# EAGLE design HLF356amp-revisi01 (EAGLE 7.6.0)
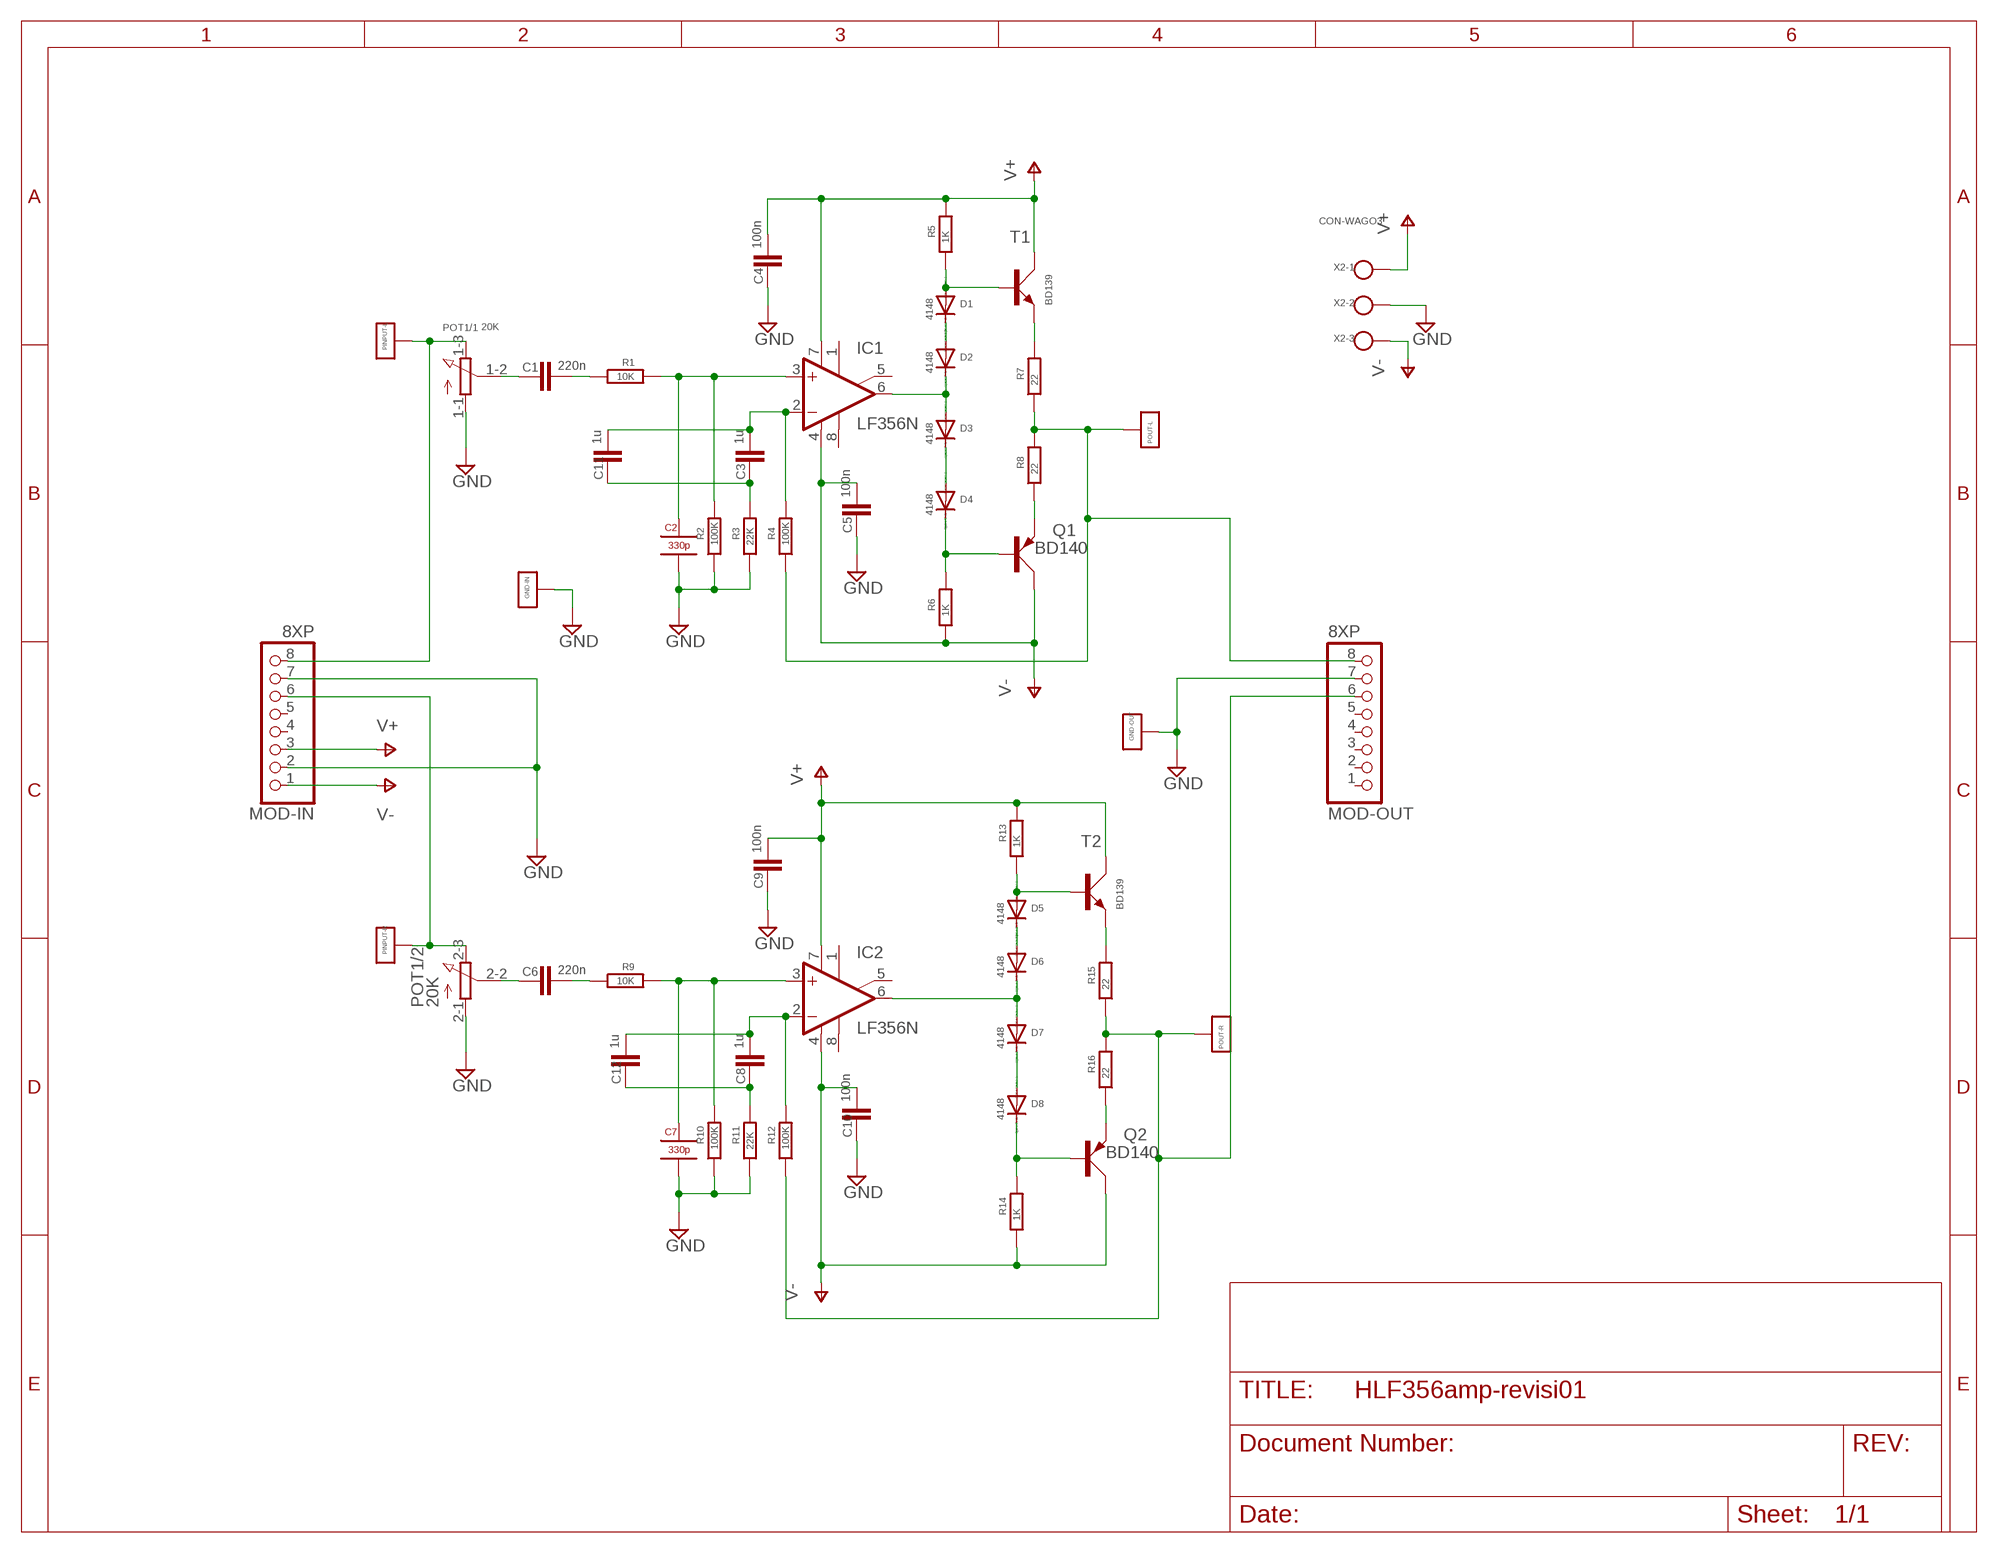
[diagram p0: schematic, sheet 1]

## Parts
C1  220n  C-EU050-025X075  [C050-025X075]
C2  330p  RIFAEVOXPFR5  [RIFAEVOX]
C3  1u  C-EU150-072X183  [C150-072X183]
C4  100n  C-EU050-025X075  [C050-025X075]
C5  100n  C-EU050-025X075  [C050-025X075]
C6  220n  C-EU050-025X075  [C050-025X075]
C7  330p  RIFAEVOXPFR5  [RIFAEVOX]
C8  1u  C-EU150-072X183  [C150-072X183]
C9  100n  C-EU050-025X075  [C050-025X075]
C10  100n  C-EU050-025X075  [C050-025X075]
C11  1u  C-EU050-075X075  [C050-075X075]
C12  1u  C-EU050-075X075  [C050-075X075]
D1  4148  1N4148DO35-7  [DO35-7]
D2  4148  1N4148DO35-7  [DO35-7]
D3  4148  1N4148DO35-7  [DO35-7]
D4  4148  1N4148DO35-7  [DO35-7]
D5  4148  1N4148DO35-7  [DO35-7]
D6  4148  1N4148DO35-7  [DO35-7]
D7  4148  1N4148DO35-7  [DO35-7]
D8  4148  1N4148DO35-7  [DO35-7]
GND-IN  PIN-BIG1X  [PIN-BIG]
GND-OUT  PIN-BIG1X  [PIN-BIG]
IC1  LF356N  [DIL08]
IC2  LF356N  [DIL08]
MOD-IN  8XP  PINHD-1X8BIG  [1X08-BIG]
MOD-OUT  8XP  PINHD-1X8BIG  [1X08-BIG]
PINPUT-L  PIN-BIG1X  [PIN-BIG]
PINPUT-R  PIN-BIG1X  [PIN-BIG]
POT1  20K  3RP/1610G  [3RP/1610G]
POUT-L  PIN-BIG1X  [PIN-BIG]
POUT-R  PIN-BIG1X  [PIN-BIG]
Q1  BD140  [TO126AV]
Q2  BD140  [TO126AV]
R1  10K  R-EU_0204/7  [0204/7]
R2  100K  R-EU_0204/7  [0204/7]
R3  22K  R-EU_0204/7  [0204/7]
R4  100K  R-EU_0204/7  [0204/7]
R5  1K  R-EU_0204/7  [0204/7]
R6  1K  R-EU_0204/7  [0204/7]
R7  22  R-EU_0204/7  [0204/7]
R8  22  R-EU_0204/7  [0204/7]
R9  10K  R-EU_0204/7  [0204/7]
R10  100K  R-EU_0204/7  [0204/7]
R11  22K  R-EU_0204/7  [0204/7]
R12  100K  R-EU_0204/7  [0204/7]
R13  1K  R-EU_0204/7  [0204/7]
R14  1K  R-EU_0204/7  [0204/7]
R15  22  R-EU_0204/7  [0204/7]
R16  22  R-EU_0204/7  [0204/7]
T1  BD139  [TO126AV]
T2  BD139  [TO126AV]
X2  CON-WAGO3  W237-103  [W237-103]

## Nets
AMP-INL: MOD-IN.8 PINPUT-L.P$1 POT1.1-3(/1:E)
AMP-INR: MOD-IN.6 PINPUT-R.P$1 POT1.2-3(/2:E)
AMP-OUTL: MOD-OUT.8 POUT-L.P$1 R4.1 R7.1 R8.2
AMP-OUTR: MOD-OUT.6 POUT-R.P$1 R12.1 R15.1 R16.2
B1: D1.A R5.1 T1.B
B2: D4.C Q1.B R6.2
B3: D5.A R13.1 T2.B
B4: D8.C Q2.B R14.2
E1: R7.2 T1.E
E2: Q1.E R8.1
E3: R15.2 T2.E
E4: Q2.E R16.1
GND: C2.P$2 C4.1 C5.1 C7.P$2 C9.1 C10.1 GND-IN.P$1 GND-OUT.P$1 MOD-IN.2 MOD-IN.7 MOD-OUT.7 POT1.1-1(/1:A) POT1.2-1(/2:A) R2.1 R3.1 R10.1 R11.1 X2.2
N$1: C2.P$1 IC1.3(+IN) R1.2 R2.2
N$2: C1.2 R1.1
N$3: C3.2 C11.2 IC1.2(-IN) R4.2
N$4: C3.1 C11.1 R3.2
N$5: C1.1 POT1.1-2(/1:S)
N$7: C7.P$1 IC2.3(+IN) R9.2 R10.2
N$9: D1.C D2.A
N$10: D2.C D3.A IC1.6(OUT)
N$11: D3.C D4.A
N$13: C6.2 R9.1
N$16: C8.2 C12.2 IC2.2(-IN) R12.2
N$17: C8.1 C12.1 R11.2
N$20: C6.1 POT1.2-2(/2:S)
N$22: D5.C D6.A
N$23: D6.C D7.A IC2.6(OUT)
N$24: D7.C D8.A
V+: C4.2 C9.2 IC1.7(V+) IC2.7(V+) MOD-IN.3 R5.2 R13.2 T1.C T2.C X2.1
V-: C5.2 C10.2 IC1.4(V-) IC2.4(V-) MOD-IN.1 Q1.C Q2.C R6.1 R14.1 X2.3
Unconnected: IC1.1(ON1) IC1.5(ON2) IC1.8(OPT) IC2.1(ON1) IC2.5(ON2) IC2.8(OPT) MOD-IN.4 MOD-IN.5 MOD-OUT.1 MOD-OUT.2 MOD-OUT.3 MOD-OUT.4 MOD-OUT.5

## Library data of the parts
C1 C3-C6 C8-C12 = resistor:C-EU: CAPACITOR, European symbol
C2 C7 = ioshub:RIFAEVOX: Rifa Evox
D1-D8 = diode:1N4148: DIODE high speed (Philips)
GND-IN GND-OUT PINPUT-L PINPUT-R POUT-L POUT-R = ioshub:PIN-BIG: 1X 1.0 mm pin big
IC1 IC2 = linear:LF356: OP AMP
MOD-IN MOD-OUT = adafruit:PINHD-1X8: PIN HEADER
POT1 = pot2:3RP/1610G: 16mm Potentiometer two level Source: http://www.alphapotentiometers.net/html/16mm_pot_2.html
Q1 Q2 = transistor-power:BD140: PNP TRANSISTOR
R1-R16 = resistor:R-EU_: RESISTOR, European symbol
T1 T2 = transistor-power:BD139: NPN TRANSISTOR
X2 = con-wago-500:W237-103: WAGO SCREW CLAMP; MPN: 237-103; OC_FARNELL: unknown; OC_NEWARK: 18M7116

## Board
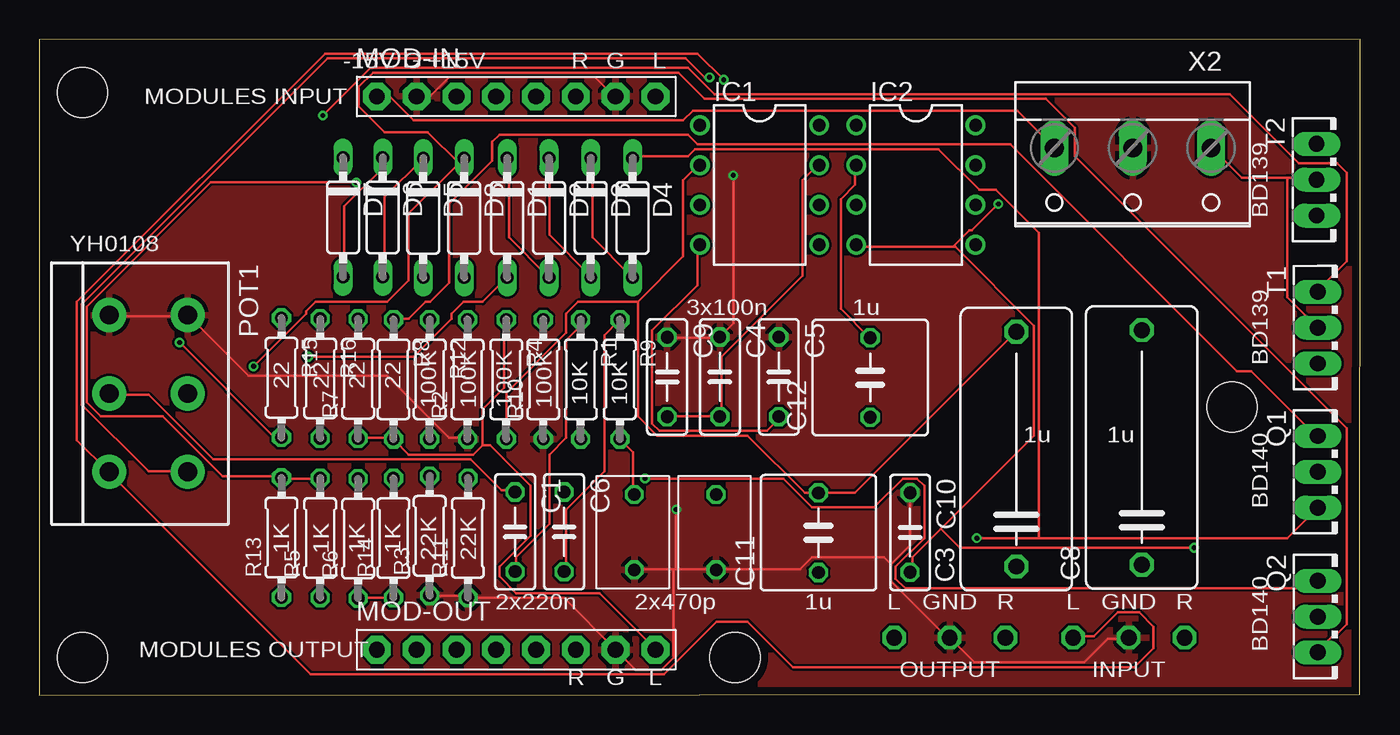
[diagram p1: board, top side]
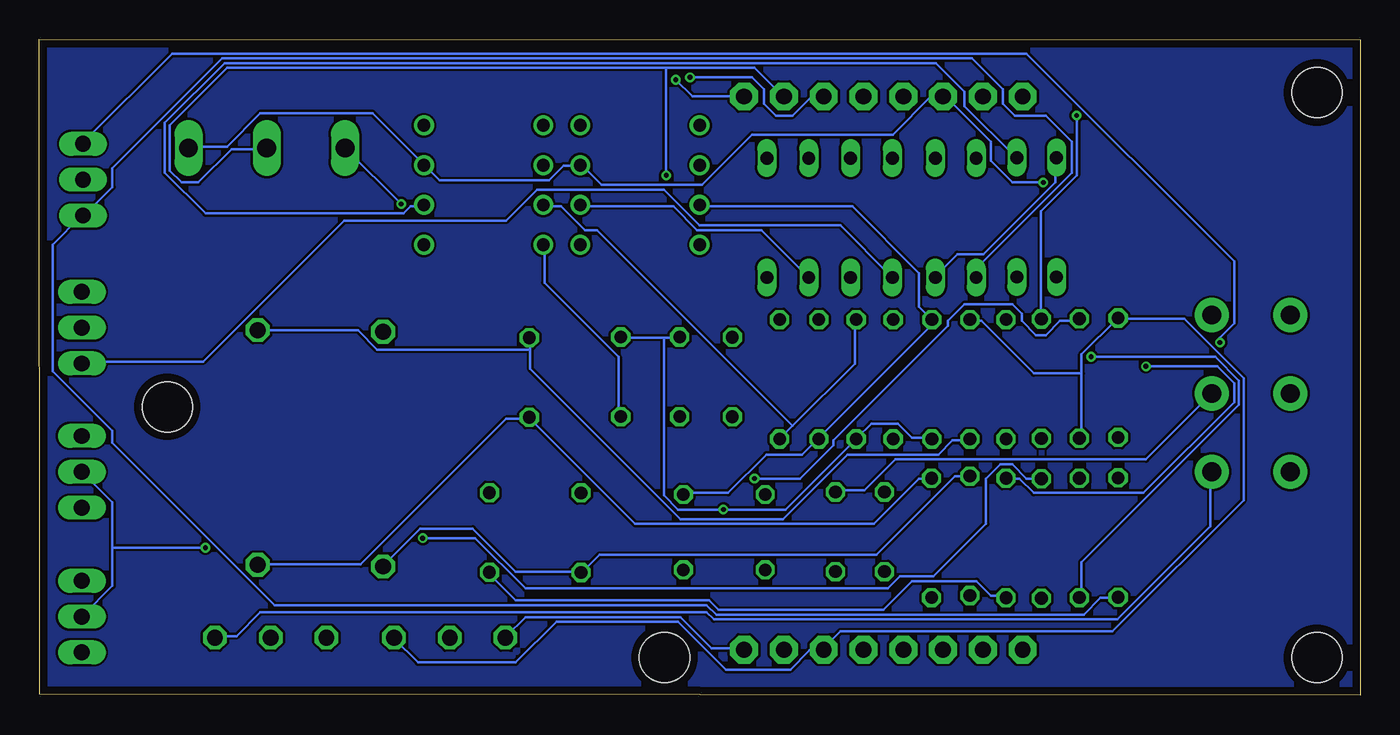
[diagram p2: board, bottom side, seen from below]

Size 84.36 x 41.88 mm. Coordinates in mm from the lower left corner, seen from the top.
Outline: 0,0 84.32,0.07 84.36,41.88 0.01,41.83 0,0
Copper layers (1*16): Top 0.035mm / dielectric 1.6mm / Bottom 0.035mm
Design rules "Elecrow_2-layer_PCB_eagle_rule": minimum track width 6mil, minimum drill 12mil, track to track 6mil, track to pad 8mil, pad to pad 12mil, via to via 12mil, smd to smd 0mil, copper to edge 20mil, drill to drill 10mil, minimum pad ring 6mil, minimum via ring 6mil, stop-mask expansion 0mil, vias tented up to drill 100mil, thermal gap 10mil
Holes 3.2 mm at 2.77,38.48 2.77,2.41 76.17,18.41 44.43,2.41

### Footprints (pad centres in the part's own frame; a part is rotated, then mirrored left to right if it is on the bottom)
C050-025X075 = drill 0.813 octagon: 1 -2.54,0; 2 2.54,0
RIFAEVOX = drill 0.8 octagon: P$1 -2.375,-0.255; P$2 2.425,-0.255
C150-072X183 = drill 1.016 octagon: 1 -7.493,0; 2 7.493,0
C050-075X075 = drill 0.813 octagon: 1 -2.54,0; 2 2.54,0
DO35-7 = drill 0.813 long: A 3.81,0; C -3.81,0
PIN-BIG = drill 1 octagon: P$1 0,0
DIL08 = drill 0.813 pad 1.27: 1 -3.81,-3.81; 2 -1.27,-3.81; 3 1.27,-3.81; 4 3.81,-3.81; 5 3.81,3.81; 6 1.27,3.81; 7 -1.27,3.81; 8 -3.81,3.81
1X08-BIG = drill 1.016 pad 1.778 octagon: 1 -8.89,0; 2 -6.35,0; 3 -3.81,0; 4 -1.27,0; 5 1.27,0; 6 3.81,0; 7 6.35,0; 8 8.89,0
3RP/1610G = drill 1.2 pad 2.184: 1-1 -5,0; 1-2 0,0; 1-3 5,0; 2-1 -5,5; 2-2 0,5; 2-3 5,5
TO126AV = drill 1.016 long: B 2.286,-1.27; C 0,-1.27; E -2.286,-1.27
0204/7 = drill 0.813 octagon: 1 -3.81,0; 2 3.81,0
W237-103 = drill 1.194 long: 1 -5,-1.29; 2 0,-1.29; 3 5,-1.29

### Placement (x,y rotation side)
C1  30.39,10.44 270 top
C2  43.48,10.44 270 top
C3  62.39,15.72 90 top
C4  43.46,20.33 270 top
C5  47.22,20.33 270 top
C6  33.51,10.44 270 top
C7  38.26,10.44 270 top
C8  70.4,15.82 90 top
C9  40.1,20.32 270 top
C10  55.61,10.4 270 top
C11  49.76,10.38 90 top
C12  53.06,20.29 90 top
D1  29.88,30.48 270 top
D2  32.55,30.48 270 top
D3  35.21,30.48 270 top
D4  37.89,30.48 270 top
D5  24.52,30.48 270 top
D6  21.93,30.51 270 top
D7  19.41,30.51 270 top
D8  27.13,30.48 270 top
GND-IN  69.57,3.68 180 top
GND-OUT  58.14,3.68 90 top
IC1  45.99,32.57 270 top
IC2  55.98,32.57 270 top
MOD-IN  30.46,38.23 0 top
MOD-OUT  30.46,2.92 0 top
PINPUT-L  66.02,3.68 180 top
PINPUT-R  73.13,3.68 180 top
POT1  4.48,19.27 270 top
POUT-L  54.59,3.68 90 top
POUT-R  61.7,3.68 90 top
Q1  82.91,14.27 270 top
Q2  82.91,5.03 270 top
R1  34.58,20.17 270 top
R2  27.35,20.17 90 top
R3  24.93,10.19 90 top
R4  29.83,20.17 270 top
R5  17.94,10.05 90 top
R6  20.36,10.01 90 top
R7  20.36,20.21 90 top
R8  22.62,20.17 270 top
R9  37.08,20.17 270 top
R10  32.19,20.17 90 top
R11  27.38,10.05 90 top
R12  24.93,20.17 270 top
R13  15.47,10.07 90 top
R14  22.62,10.04 90 top
R15  15.47,20.27 270 top
R16  17.94,20.23 270 top
T1  82.91,23.47 270 top
T2  82.83,32.91 270 top
X2  69.82,33.65 180 top

### Tracks (layer width: path | path; a pad name or v marks a point on that pad's centre or on a via)
AMP-INL  (via drill 0.3)
  Top 0.152: v43.71,39.29 42.04,40.97 18.26,40.97 2.41,25.12 2.41,16.28 4.39,14.3 POT1.1-3 4.55,14.15 17.35,1.34 39.9,1.34 43.26,4.7 45.24,4.7 48.13,1.8 69.93,1.8 71.15,3.02 71.15,4.39 70.23,5.31 68.86,5.31 67.34,3.78 66.12,3.78 PINPUT-L.P$1
  Bottom 0.152: MOD-IN.8 42.65,38.23 v43.71,39.29
AMP-INR  (via drill 0.3)
  Top 0.152: v42.8,39.44 42.5,39.44 41.27,40.66 18.42,40.66 2.72,24.97 2.72,18.57 6.98,14.3 9.42,14.3 POT1.2-3
  Bottom 0.152: MOD-IN.6 35.03,38.23 36.25,37.01 37.31,37.01 38.08,37.77 38.08,38.68 38.84,39.44 v42.8,39.44 | PINPUT-R.P$1 73.13,3.78 71.75,3.78 70.23,5.31 41.73,5.31 41.27,4.85 15.52,4.85 9.58,10.79 9.58,14.15 POT1.2-3
AMP-OUTL
  Top 0.152: R7.1 20.4,16.43 22.53,16.43 R8.2 22.68,16.28 23.6,15.37 27.71,15.37 28.32,15.97 | 28.32,15.97 28.32,18.26 29.69,19.63 29.69,23.9 R4.1 | 28.32,15.97 28.78,15.97 31.37,13.38 31.37,10.18 29.39,8.2 29.39,7.59 30.46,6.53 35.79,6.53 39.29,3.02 MOD-OUT.8
  Bottom 0.152: MOD-OUT.8 39.45,3.02 41.43,3.02 43.41,5 53.32,5 54.53,3.78 POUT-L.P$1
AMP-OUTR
  Bottom 0.152: 17.81,20.55 17.81,16.43 R16.2 | 17.81,20.55 17.81,21.77 15.52,24.05 R15.1 15.37,24.05 11.25,24.05 7.44,20.24 7.44,12.47 15.82,4.09 33.2,4.09 34.27,3.02 MOD-OUT.6 34.27,2.87 35.18,2.87 36.4,1.65 40.51,1.65 43.56,4.7 51.33,4.7 53.93,2.11 60.17,2.11 61.7,3.63 POUT-R.P$1 | 17.81,20.55 20.85,20.55 24.21,23.9 24.82,23.9 R12.1
B1  (via drill 0.3)
  Top 0.152: v17.2,21.61 23.9,21.61 26.34,24.05 26.34,24.36 27.1,25.12 28.32,25.12 29.85,26.64 D1.A
  Bottom 0.152: v17.2,21.61 9.27,21.61 7.75,20.09 7.75,18.57 17.81,8.51 17.81,6.37 R5.1 | T1.B 81.51,21.31 73.89,21.31 64.9,30.3 54.53,30.3 52.55,32.28 44.48,32.28 42.19,30 33.2,30 30,26.8 D1.A
B2  (via drill 0.3)
  Top 0.152: 63.83,10.03 79.68,10.03 81.51,11.86 Q1.B | 63.83,10.03 v59.87,10.03 | 63.83,10.03 63.83,29.54 61.09,32.28 60.02,32.28 57.43,34.87 41.88,34.87 41.43,34.41 37.92,34.41 D4.C
  Bottom 0.152: v59.87,10.03 56.52,10.03 53.32,6.83 30.15,6.83 29.39,7.59 27.26,7.59 23.9,10.95 23.9,13.84 22.99,14.76 22.23,14.76 21.31,13.84 20.4,13.84 R6.2
B3
  Bottom 0.152: R13.1 15.52,6.22 16.59,6.22 17.65,5.15 41.12,5.15 41.73,5.76 69.32,5.76 79.68,16.13 79.68,16.89 83.49,20.7 83.49,28.78 81.66,30.61 T2.B 81.51,30.61 79.68,32.43 79.68,33.65 72.67,40.66 24.82,40.66 22.84,38.68 22.84,37.77 22.07,37.01 20.09,37.01 18.42,35.33 18.42,33.35 24.51,27.25 24.51,26.8 D5.A
B4  (via drill 0.3)
  Top 0.152: v13.69,21 17.04,24.36 17.04,24.51 17.65,25.12 22.23,25.12 23.6,26.49 23.6,30.76 26.8,33.96 | 26.8,33.96 27.1,34.26 D8.C 26.8,33.96 | 26.8,33.96 24.82,35.94 22.07,35.94 20.4,37.62 20.4,38.84 21.31,39.75 40.82,39.75 42.5,38.07 64.29,38.07 66.12,36.24 66.12,34.41 83.49,17.04 83.49,4.54 82.88,3.94 82.73,3.94 81.66,2.87 Q2.B
  Bottom 0.152: v13.69,21 9.12,21 8.05,19.94 8.05,18.72 13.84,12.93 20.85,12.93 21.77,13.84 22.53,13.84 R14.2
E1  (via drill 0.3)
  Top 0.152: v18.11,37.01 21.16,40.05 41.43,40.05 43.1,38.38 76.02,38.38 80.44,33.96 82.88,33.96 83.49,33.35 83.49,27.71 81.66,25.88 T1.E
  Bottom 0.152: v18.11,37.01 18.11,33.2 20.4,30.91 20.4,24.05 R7.2
E2
  Top 0.152: R8.1 22.68,24.05 23.6,24.05 24.66,25.12 24.97,25.12 26.19,26.34 26.19,31.37 28.93,34.11 28.93,35.33 29.39,35.79 41.43,35.79 42.04,35.18 62,35.18 76.48,20.7 77.39,20.7 81.51,16.58 Q1.E
E3  (via drill 0.3)
  Top 0.152: v8.97,22.53 14.91,16.58 15.37,16.58 R15.2
  Bottom 0.152: v8.97,22.53 8.97,22.83 8.05,23.75 8.05,27.71 21.31,40.97 75.87,40.97 81.51,35.33 T2.E
E4  (via drill 0.3)
  Top 0.152: v38.69,13.84 47.52,13.84 49.35,12.01 53.32,12.01 55.14,13.84 56.06,13.84 56.52,13.38 56.52,10.03 54.69,8.2 54.69,7.44 55.3,6.83 81.05,6.83 81.51,7.29 Q2.E
  Bottom 0.152: v38.69,13.84 35.79,13.84 33.66,15.97 33.66,16.28 26.34,23.59 26.34,23.9 25.27,24.97 22.23,24.97 21.62,24.36 21.62,23.9 20.7,22.98 20.09,22.98 19.18,23.9 17.96,23.9 R16.1
GND  (via drill 0.3)
  Top 0.152: 40.67,8.05 43.1,8.05 C2.P$2 43.26,8.05 48.59,8.05 49.35,8.81 53.93,8.81 54.38,8.36 | 40.67,8.05 40.51,8.05 | 40.51,8.05 38.08,8.05 C7.P$2 | R3.1 24.97,6.37 27.26,6.37 R11.1 27.41,6.22 33.5,6.22 MOD-OUT.7 38.08,1.65 39.75,1.65 40.51,2.41 40.51,8.05 | 54.38,8.36 55.6,9.57 55.6,12.93 C10.1 | 54.38,8.36 54.38,7.29 58.04,3.63 GND-OUT.P$1 59.72,2.11 66.73,2.11 68.25,3.63 69.47,3.63 GND-IN.P$1 | MOD-IN.2 24.97,38.23 26.19,39.44 35.48,39.44 36.7,38.23 MOD-IN.7 | C9.1 40.21,22.83 43.41,22.83 C4.1 43.56,22.98 44.32,23.75 v44.32,33.2 | R2.1 27.26,16.43 26.19,16.43 22.23,20.39 13.39,20.39 9.58,24.2 POT1.2-1 9.42,24.2 4.55,24.2 POT1.1-1 | v40.67,11.86 40.67,8.05
  Bottom 0.152: 44.32,40.05 38.69,40.05 36.86,38.23 MOD-IN.7 | 44.32,40.05 72.36,40.05 76.02,36.4 76.02,33.5 75.26,32.74 74.19,32.74 72.06,34.87 69.93,34.87 X2.2 | 44.48,22.83 43.56,22.83 C4.1 | 44.48,22.83 47.22,22.83 C5.1 | R2.1 27.41,16.43 28.63,16.43 29.54,17.35 31.22,17.35 32.13,16.43 R10.1 32.28,16.28 36.7,11.86 v40.67,11.86 43.56,11.86 44.48,12.77 44.48,22.83 | v44.32,33.2 44.32,40.05
  pour Top: 0.23,0.12 84.3,0.12 84.3,42.03 -0.03,42.03
N$1
  Bottom 0.152: C2.P$1 43.1,12.93 40.36,12.93 37.92,15.37 35.64,15.37 34.72,16.28 R1.2 34.57,16.43 27.41,23.59 27.41,23.9 R2.2 27.41,24.05 28.17,24.81 28.17,26.95 32.44,31.21 42.04,31.21 IC1.3
N$2
  Top 0.152: C1.2 30.46,8.05 30.46,8.81 32.59,10.95 32.59,15.37 33.66,16.43 33.66,22.68 34.57,23.59 34.57,23.9 R1.1
N$3
  Top 0.152: C3.2 62.31,23.14 52.1,12.93 49.81,12.93 C11.2 49.66,12.93 48.9,12.93 45.24,16.58 39.45,16.58 38.23,17.8 38.23,25.12 | 38.23,25.12 34.42,25.12 33.66,24.36 33.66,23.14 29.85,19.33 29.85,16.43 R4.2 | 38.23,25.12 41.12,28.01 41.12,32.89 42.04,33.8 IC1.2
N$4
  Bottom 0.152: C3.1 62.31,8.36 60.02,10.64 56.67,10.64 53.93,7.9 49.81,7.9 C11.1 49.66,7.9 48.59,8.96 30.91,8.96 25.88,13.99 24.97,13.99 R3.2
N$5
  Top 0.152: C1.1 30.3,13.08 29.54,13.08 27.56,15.06 11.1,15.06 6.98,19.18 4.55,19.18 POT1.1-2
N$6
  pour Bottom: -0.03,0.38 84.3,0.12 84.3,42.03 -0.03,42.03
N$7
  Top 0.152: C7.P$1 37.92,12.93 37.92,15.52 37.16,16.28 R9.2
  Bottom 0.152: 36.25,17.19 37.01,16.43 R9.2 | 36.25,17.19 32.28,21.16 32.28,23.9 R10.2 | 36.25,17.19 48.74,29.69 49.51,29.69 51.03,31.21 52.1,31.21 IC2.3
N$9
  Top 0.152: D1.C 30,34.26 30,29.23 32.44,26.8 D2.A
N$10
  Top 0.152: D2.C 32.59,34.26 32.59,29.39 35.18,26.8 D3.A
  Bottom 0.152: IC1.6 49.66,31.21 43.87,31.21 42.34,29.69 38.23,29.69 35.33,26.8 D3.A
N$11
  Top 0.152: D3.C 35.33,34.26 35.33,29.23 37.77,26.8 D4.A
N$13
  Top 0.152: C6.2 33.66,8.05 33.66,11.86 36.09,14.3 36.09,22.98 37.01,23.9 R9.1
N$16
  Top 0.152: IC2.2 52.1,33.8 52.1,32.59 51.18,31.67 51.18,24.66 53.01,22.83 C12.2
  Bottom 0.152: 53.01,22.07 53.01,22.68 C12.2 | 53.01,22.07 53.01,20.85 43.41,11.25 36.86,11.25 32.74,15.37 26.95,15.37 26.04,16.28 24.97,16.28 R12.2 | 53.01,22.07 62.76,22.07 63.98,23.29 70.38,23.29 C8.2
N$17
  Bottom 0.152: R11.2 27.41,13.84 28.17,13.84 31.07,10.95 46.3,10.95 53.01,17.65 C12.1 53.16,17.65 54.53,17.65 63.83,8.36 70.38,8.36 C8.1
N$20
  Bottom 0.152: C6.1 33.5,13.08 31.67,13.08 29.69,15.06 13.69,15.06 9.58,19.18 POT1.2-2
N$22
  Top 0.152: D6.A 22.07,26.8 22.07,31.82 24.51,34.26 D5.C
N$23
  Top 0.152: D7.A 19.48,26.8 19.48,31.21 21.92,33.65 21.92,34.26 D6.C
  Bottom 0.152: IC2.6 59.87,31.21 60.63,31.21 61.09,30.76 73.74,30.76 76.33,33.35 76.33,36.55 72.52,40.36 27.1,40.36 25.27,38.53 25.27,37.62 22.07,34.41 D6.C
N$24
  Bottom 0.152: D7.C 19.48,34.26 19.48,32.74 24.05,28.17 25.73,28.17 27.1,26.8 D8.A
V+  (via drill 0.3)
  Top 0.152: R5.2 17.81,13.84 15.52,13.84 R13.2 15.37,13.99 11.71,13.99 7.9,17.8 3.94,17.8 3.02,18.72 3.02,24.81 10.95,32.74 v20.24,32.74 | 79.68,33.04 76.78,33.04 74.96,34.87 X2.1 | 79.68,33.04 81.51,33.04 T2.C | 79.68,33.04 79.68,25.42 81.51,23.59 T1.C | C9.2 40.21,17.8 43.41,17.8 C4.2 43.56,17.8 43.56,21.61 48.74,26.8 48.74,32.89 49.66,33.8 IC1.7
  Bottom 0.152: v20.24,32.74 22.23,32.74 23.6,34.11 23.6,35.33 26.49,38.23 MOD-IN.3 27.41,38.23 29.85,35.79 38.84,35.79 42.04,32.59 48.44,32.59 49.66,33.8 IC1.7 49.81,33.8 50.88,33.8 51.79,32.89 58.8,32.89 59.72,33.8 IC2.7 59.87,33.96 63.07,37.16 70.23,37.16 72.36,35.02 74.8,35.02 X2.1
V-  (via drill 0.3)
  Top 0.152: MOD-IN.1 22.38,38.23 23.9,36.7 41.12,36.7 41.73,37.31 62.46,37.31 64.74,35.02 X2.3 | R6.1 20.4,6.22 22.53,6.22 R14.1 | 57.58,10.64 63.53,16.58 63.53,23.59 58.5,28.62 58.34,28.62 | 57.58,10.64 55.75,8.81 55.75,7.9 C10.2 | 58.34,28.62 52.25,28.62 IC2.4 | IC1.4 42.04,28.62 42.04,26.18 39.14,23.29 39.14,17.35 39.6,16.89 46.46,16.89 47.22,17.65 C5.2 | v73.74,9.42 58.8,9.42 57.58,10.64 | v61.24,31.37 59.56,29.69 59.41,29.69 58.34,28.62
  Bottom 0.152: 79.68,9.42 79.68,12.32 81.51,14.15 Q1.C | 79.68,9.42 79.68,6.98 81.51,5.15 Q2.C | C5.2 47.37,17.8 47.37,21.61 52.1,26.34 52.1,28.62 IC2.4 | R14.1 22.68,6.37 23.6,6.37 24.51,7.29 28.63,7.29 30.46,5.46 40.97,5.46 41.58,6.07 53.93,6.07 55.6,7.75 C10.2 | v73.74,9.42 79.68,9.42 | v61.24,31.37 64.74,34.87 X2.3

### Text on the board
tPlace: -15V | G | +15V | R | G | L | MODULES INPUT | BD139 | YH0108 | 3x100n | 1u | BD139 | 22 | 22 | 22 | 22 | 100K | 100K | 100K | 100K | 10K | 10K | 1u | 1u | BD140 | 1K | 1K | 1K | 1K | 22K | 22K | 2x220n | 2x470p | 1u | L | GND | R | L | GND | R | BD140 | MODULES OUTPUT | OUTPUT | INPUT | R | G | L